# EAGLE design SmartDriveTestStand (EAGLE 9.1.3)
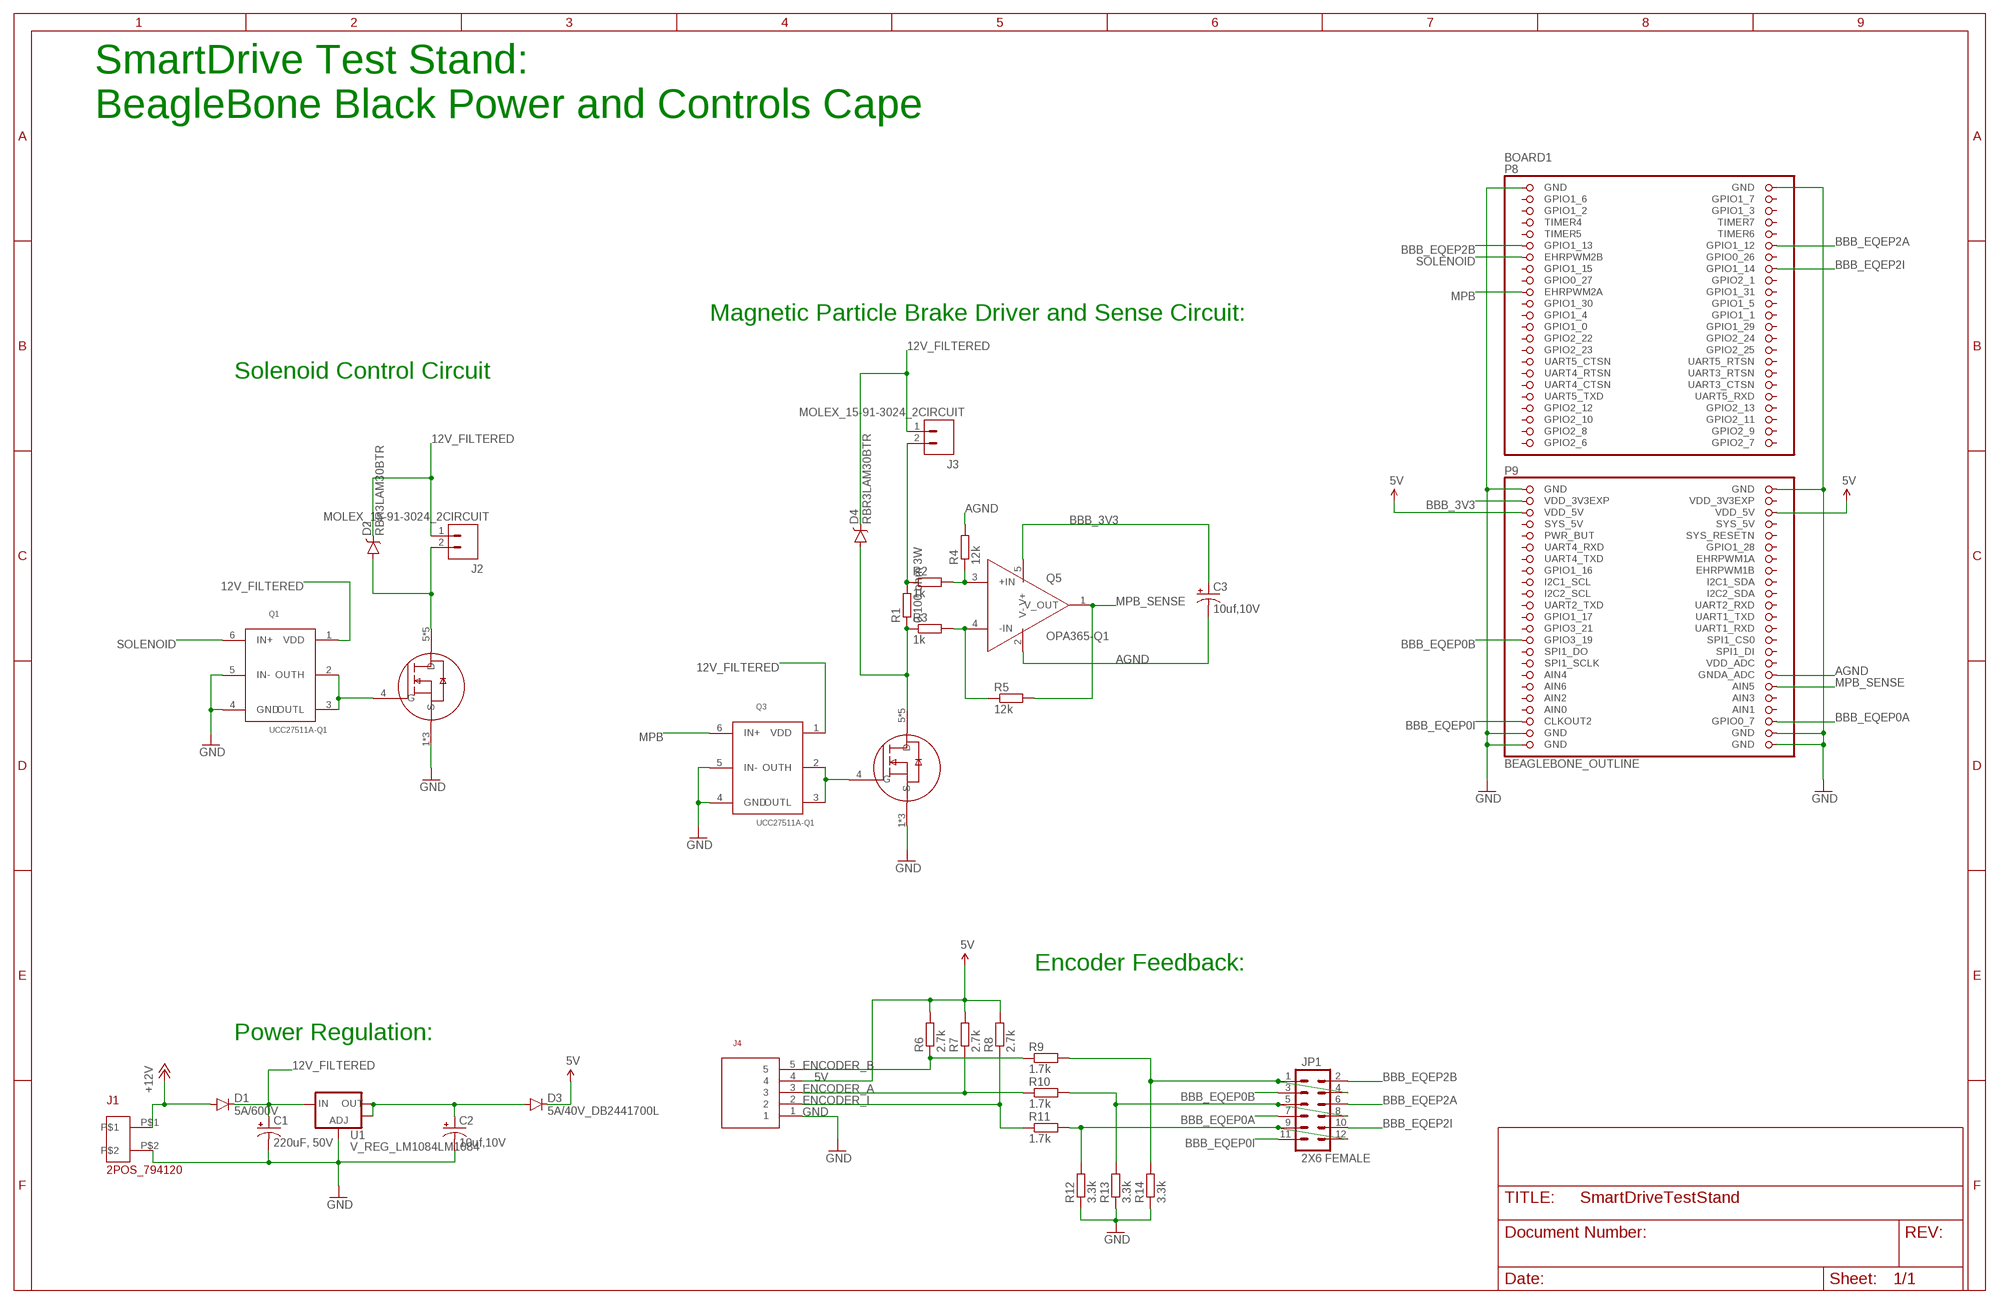
[diagram p0: schematic, sheet 1]

## Parts
BOARD1  BEAGLEBONE_OUTLINE  [BEAGLEBONE_SHIELD]
C1  220uF, 50V  CAP_POLG  [PANASONIC_G]
C2  10uf,10V  CAP_POL1206  [EIA3216]
C3  10uf,10V  CAP_POL1206  [EIA3216]
D1  5A/600V  DIODEES3J  [SMC]
D2  RBR3LAM30BTR  DIODE-SCHOTTKYRBR3LAM30B  [SMA-DIODE]
D3  5A/40V_DB2441700L  DIODESMA-ALT  [SMA-DIODE_ALT]
D4  RBR3LAM30BTR  DIODE-SCHOTTKYRBR3LAM30B  [SMA-DIODE]
J1  2POS_794120  [2POS_794120-1]
J2  MOLEX_15-91-3024_2CIRCUIT  [MOLEX15-91-3024_2CIRCUIT]
J3  MOLEX_15-91-3024_2CIRCUIT  [MOLEX15-91-3024_2CIRCUIT]
J4  MOLEX_15-91-3053_5CIRCUIT  [MOLEX15-91-3053-5CIRCUIT]
JP1  2X6 FEMALE  M06X2PTH_FEMALE  [2X6]
Q1  UCC27511A-Q1  [SOT23-6]
Q2  MOSFET_NCHANNELTI_CSD18533Q5A  [SON_5X6MM_NEXFET]
Q3  UCC27511A-Q1  [SOT23-6]
Q4  MOSFET_NCHANNELTI_CSD18533Q5A  [SON_5X6MM_NEXFET]
Q5  OPA365-Q1  [SOT23-5]
R1  0.100 ohm 3W  RESISTOR-2512  [RESISTOR-2512]
R2  1k  RESISTOR-0603  [RESISTOR-0603]
R3  1k  RESISTOR-0603  [RESISTOR-0603]
R4  12k  RESISTOR-0603  [RESISTOR-0603]
R5  12k  RESISTOR-0603  [RESISTOR-0603]
R6  2.7k  RESISTOR-0603  [RESISTOR-0603]
R7  2.7k  RESISTOR-0603  [RESISTOR-0603]
R8  2.7k  RESISTOR-0603  [RESISTOR-0603]
R9  1.7k  RESISTOR-0603  [RESISTOR-0603]
R10  1.7k  RESISTOR-0603  [RESISTOR-0603]
R11  1.7k  RESISTOR-0603  [RESISTOR-0603]
R12  3.3k  RESISTOR-0603  [RESISTOR-0603]
R13  3.3k  RESISTOR-0603  [RESISTOR-0603]
R14  3.3k  RESISTOR-0603  [RESISTOR-0603]
U1  V_REG_LM1084LM1084  [TO-263-3]

## Nets
5V: BOARD1.51(VDD_5V) BOARD1.52(VDD_5V) D3.C J4.4 R6.P$2 R7.P$2 R8.P$2
12V_FILTERED: C1.+ D1.C D2.C D4.C J2.1 J3.1 Q1.1(VDD) Q3.1(VDD) U1.3(IN)
+12V: D1.A J1.P$1
AGND: BOARD1.80(GNDA_ADC) C3.C(-) Q5.2(V-) R4.P$2
BBB_3V3: BOARD1.49(VDD_3V3EXP) C3.A(+) Q5.5(V+)
BBB_EQEP0A: BOARD1.88(GPIO0_7) JP1.7
BBB_EQEP0B: BOARD1.73(GPIO3_19) JP1.3
BBB_EQEP0I: BOARD1.87(CLKOUT2) JP1.11
BBB_EQEP2A: BOARD1.12(GPIO1_12) JP1.6
BBB_EQEP2B: BOARD1.11(GPIO1_13) JP1.2
BBB_EQEP2I: BOARD1.16(GPIO1_14) JP1.10
ENCA_1V8: JP1.5 JP1.8 R10.P$2 R13.P$2
ENCB_1V8: JP1.1 JP1.4 R9.P$2 R14.P$2
ENCI_1V8: JP1.9 JP1.12 R11.P$2 R12.P$2
ENCODER_A: J4.3 R7.P$1 R10.P$1
ENCODER_B: J4.5 R6.P$1 R9.P$1
ENCODER_I: J4.2 R8.P$1 R11.P$1
GND: BOARD1.1(GND) BOARD1.2(GND) BOARD1.47(GND) BOARD1.48(GND) BOARD1.89(GND) BOARD1.90(GND) BOARD1.91(GND) BOARD1.92(GND) C1.- C2.C(-) J1.P$2 J4.1 Q1.4(GND) Q1.5(IN-) Q2.1(S) Q2.2(S) Q2.3(S) Q3.4(GND) Q3.5(IN-) Q4.1(S) Q4.2(S) Q4.3(S) R12.P$1 R13.P$1 R14.P$1 U1.1(ADJ)
MPB: BOARD1.19(EHRPWM2A) Q3.6(IN+)
MPB_SENSE: BOARD1.82(AIN5) Q5.1(V_OUT) R5.P$2
N$1: Q3.2(OUTH) Q3.3(OUTL) Q4.4(G)
N$2: D4.A Q4.5(D) Q4.6(D) Q4.7(D) Q4.8(D) Q4.PAD(D) R1.1 R3.P$1
N$4: Q5.3(+IN) R2.P$2 R4.P$1
N$5: Q5.4(-IN) R3.P$2 R5.P$1
N$6: Q1.2(OUTH) Q1.3(OUTL) Q2.4(G)
N$7: D2.A J2.2 Q2.5(D) Q2.6(D) Q2.7(D) Q2.8(D) Q2.PAD(D)
N$8: J3.2 R1.2 R2.P$1
SOLENOID: BOARD1.13(EHRPWM2B) Q1.6(IN+)
VOUT: C2.A(+) D3.A U1.2(OUT) U1.4(OUT)
Unconnected: BOARD1.3(GPIO1_6) BOARD1.4(GPIO1_7) BOARD1.5(GPIO1_2) BOARD1.6(GPIO1_3) BOARD1.7(TIMER4) BOARD1.8(TIMER7) BOARD1.9(TIMER5) BOARD1.10(TIMER6) BOARD1.14(GPIO0_26) BOARD1.15(GPIO1_15) BOARD1.17(GPIO0_27) BOARD1.18(GPIO2_1) BOARD1.20(GPIO1_31) BOARD1.21(GPIO1_30) BOARD1.22(GPIO1_5) BOARD1.23(GPIO1_4) BOARD1.24(GPIO1_1) BOARD1.25(GPIO1_0) BOARD1.26(GPIO1_29) BOARD1.27(GPIO2_22) BOARD1.28(GPIO2_24) BOARD1.29(GPIO2_23) BOARD1.30(GPIO2_25) BOARD1.31(UART5_CTSN) BOARD1.32(UART5_RTSN) BOARD1.33(UART4_RTSN) BOARD1.34(UART3_RTSN) BOARD1.35(UART4_CTSN) BOARD1.36(UART3_CTSN) BOARD1.37(UART5_TXD) BOARD1.38(UART5_RXD) BOARD1.39(GPIO2_12) BOARD1.40(GPIO2_13) BOARD1.41(GPIO2_10) BOARD1.42(GPIO2_11) BOARD1.43(GPIO2_8) BOARD1.44(GPIO2_9) BOARD1.45(GPIO2_6) BOARD1.46(GPIO2_7) BOARD1.54(SYS_5V) BOARD1.55(PWR_BUT) BOARD1.56(SYS_RESETN) BOARD1.57(UART4_RXD) BOARD1.58(GPIO1_28) BOARD1.59(UART4_TXD) BOARD1.60(EHRPWM1A) BOARD1.61(GPIO1_16) BOARD1.62(EHRPWM1B) BOARD1.63(I2C1_SCL) BOARD1.64(I2C1_SDA) BOARD1.65(I2C2_SCL) BOARD1.66(I2C2_SDA) BOARD1.67(UART2_TXD) BOARD1.68(UART2_RXD) BOARD1.69(GPIO1_17) BOARD1.70(UART1_TXD) BOARD1.71(GPIO3_21) BOARD1.72(UART1_RXD) BOARD1.74(SPI1_CS0) BOARD1.75(SPI1_DO) BOARD1.76(SPI1_DI) BOARD1.77(SPI1_SCLK) BOARD1.78(VDD_ADC) BOARD1.79(AIN4) BOARD1.81(AIN6) BOARD1.83(AIN2) BOARD1.84(AIN3) BOARD1.86(AIN1)

## Notes on the sheet
- SmartDrive Test Stand: 
  BeagleBone Black Power and Controls Cape
- Magnetic Particle Brake Driver and Sense Circuit:
- Solenoid Control Circuit
- Encoder Feedback:
- Power Regulation:

## Power pins joined to a net without a drawn wire
AIN0: BOARD1.85(AIN0)
SYS_5V: BOARD1.53(SYS_5V)
VDD_3V3EXP: BOARD1.50(VDD_3V3EXP)

## Library data of the parts
BOARD1 = adafruit:BEAGLEBONE_OUTLINE: Should match A3 pinout - but not completely tested
C1 = SmartDrive-TestStand:CAP_POL: Capacitor Polarized These are standard SMD and PTH capacitors. Normally 10uF, 47uF, and 100uF in electrolytic and tantalum varieties. Always verify the external diameter of the through hole cap, it varies with capacity, voltage, and manufacturer. The EIA devices should be standard.; MANEX: 123-0004264
C2 C3 = SparkFun-Passives:CAP_POL: Capacitor Polarized These are standard SMD and PTH capacitors. Normally 10uF, 47uF, and 100uF in electrolytic and tantalum varieties. Always verify the external diameter of the through hole cap, it varies with capacity, voltage, and manufacturer. The EIA devices should be standard.; MANEX: 123-0001192
D1 = SparkFun-DiscreteSemi:DIODE: Diode These are standard reverse protection diodes and small signal diodes. SMA package can handle up to about 1A. SOD-323 can handle about 200mA. What the SOD-323 package when ordering, there are some mfgs out there that are 5-pin packages.; MANEX: 130-0001388; PROD_ID: DIO-12441; VALUE: 3A/600V
D2 D4 = SmartDrive-TestStand:DIODE-SCHOTTKY: Schottky diodes
D3 = SparkFun-DiscreteSemi:DIODE: Diode These are standard reverse protection diodes and small signal diodes. SMA package can handle up to about 1A. SOD-323 can handle about 200mA. What the SOD-323 package when ordering, there are some mfgs out there that are 5-pin packages.; MANEX: 130-0002546
J1 = AMP_Mate_N_lock_conncetor:2POS_794120
J2 J3 = SmartDrive-TestStand:MOLEX_15-91-3024_2CIRCUIT: MOLEX 15-91-3024 2 position connector; MANEX: 257-0004040
J4 = SmartDrive-TestStand:MOLEX_15-91-3053_5CIRCUIT
JP1 = SparkFun-Connectors:M06X2; PROD_ID: CONN-12423
Q1 Q3 = SmartDrive-TestStand:UCC27511A-Q1
Q2 Q4 = SmartDrive-TestStand:MOSFET_NCHANNEL: N-Channel QFET MOSFET FQB30N06L 60V, 32A, 35mOhm
Q5 = SmartDrive-TestStand:OPA365-Q1: OPA365-Q1 50MHz Low-Distortion High-CMRR Rail-to-Rail I/O, Single-Supply Operational Amplifier
R1 = SmartDrive-TestStand:RESISTOR-2512: Resistor SMD 2512
R2-R14 = SmartDrive-TestStand:RESISTOR-0603: Resistor 0603 SMD
U1 = SmartDrive-TestStand:V_REG_LM1084: LM1084 5A low-drop positive voltage regulator The LM1084xx is a low drop voltage regulator able to provide up to 5 A of output current. Dropout is guaranteed at a maximum of 1.5 V at the maximum output current, decreasing at lower loads. The LM1084xx is pin to pin compatible with the older 3-terminal adjustable regulators, but has better performances in term of drop and output tolerance.

## Net classes
0 default: width 0.152 mm, drill 0.305 mm, clearance 0.152 mm

## Board
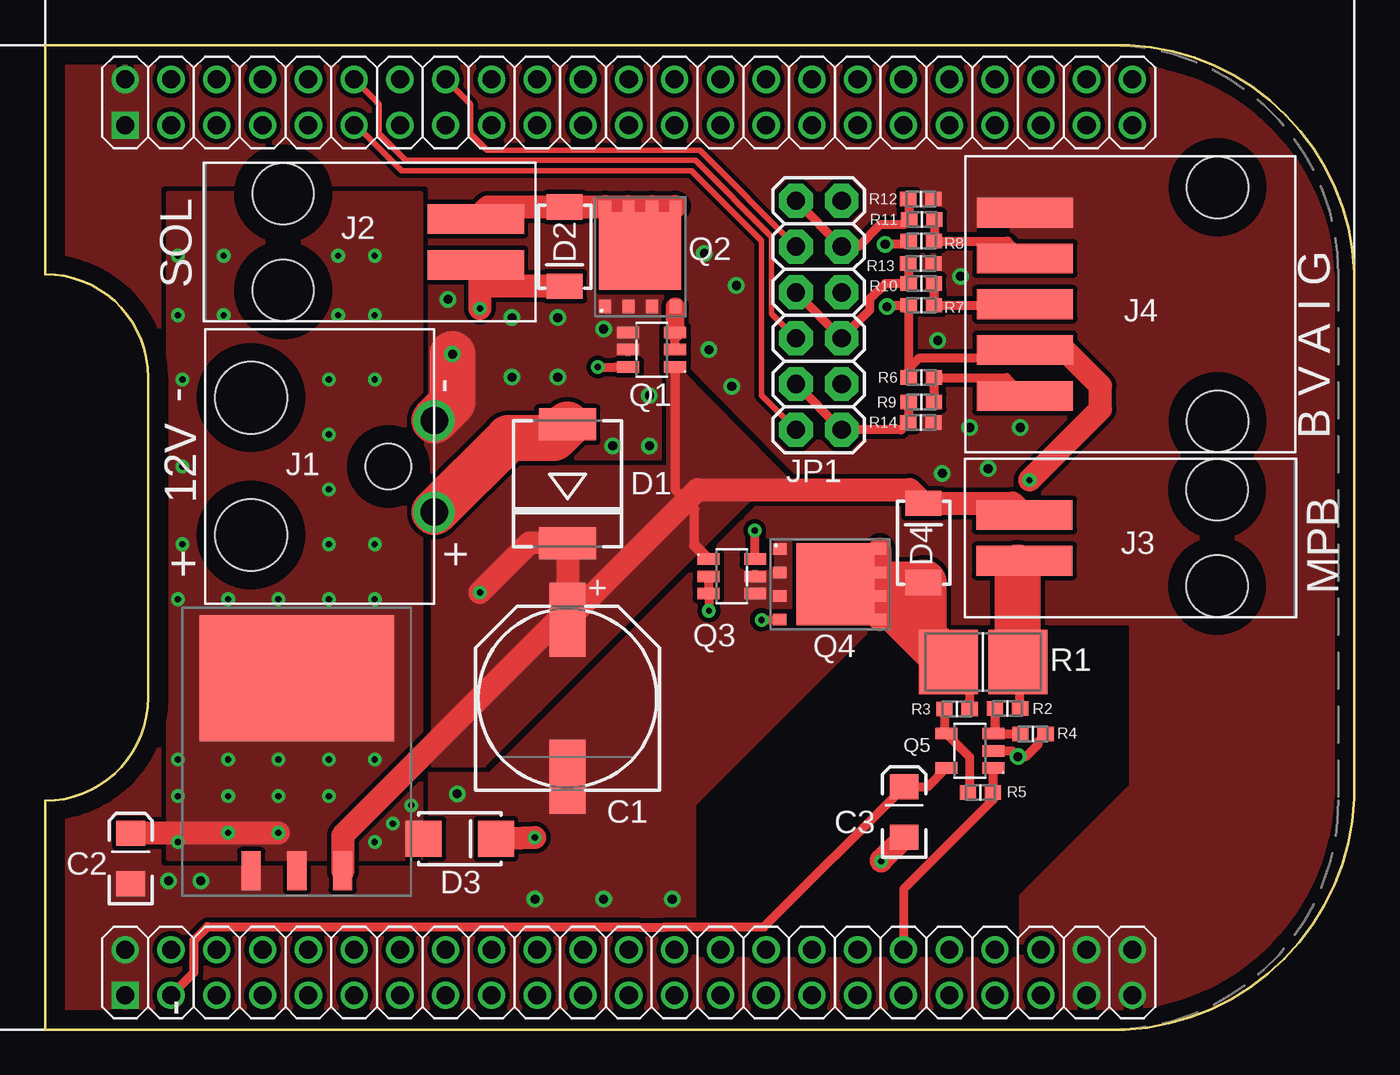
[diagram p1: board, top side]
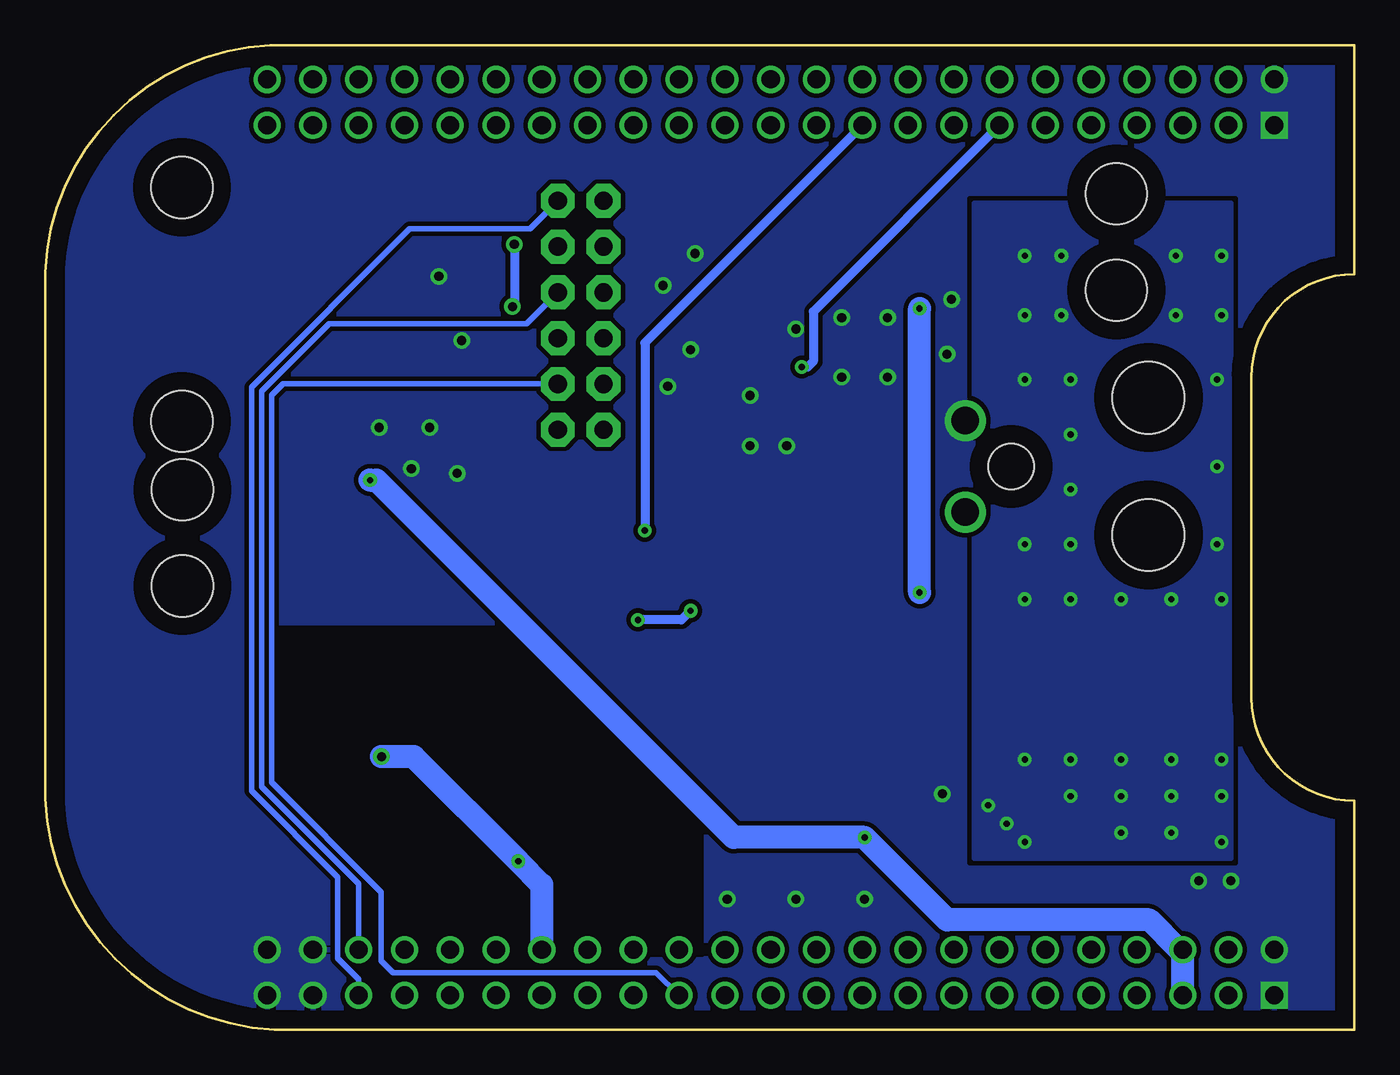
[diagram p2: board, bottom side, seen from below]

Size 72.64 x 54.61 mm. Coordinates in mm from the lower left corner, seen from the top.
Outline: 58.67,0 0,0 0,12.7 arc90 5.71,18.41 5.71,36.2 arc90 0,41.91 0,54.61 58.93,54.61 arc-90 72.64,42.01 72.64,12.8 arc-90 58.67,0
Copper layers (1*16): Top 0.035mm / dielectric 1.5mm / Bottom 0.035mm
Design rules "TestStand": minimum track width 12mil, minimum drill 0.35mm, track to track 10mil, track to pad 10mil, pad to pad 10mil, via to via 10mil, smd to smd 10mil, copper to edge 40mil, drill to drill 6mil, minimum pad ring 10mil, minimum via ring 8mil, stop-mask expansion 4mil, vias tented up to drill 0mil, thermal gap 0mil

### Footprints (pad centres in the part's own frame; a part is rotated, then mirrored left to right if it is on the bottom)
BEAGLEBONE_SHIELD = drill 1 square: 1 4.445,19.05; 47 52.705,19.05 | drill 1: 2 1.905,19.05; 3 4.445,21.59; 4 1.905,21.59; 5 4.445,24.13; 6 1.905,24.13; 7 4.445,26.67; 8 1.905,26.67; 9 4.445,29.21; 10 1.905,29.21; 11 4.445,31.75; 12 1.905,31.75; 13 4.445,34.29; 14 1.905,34.29; 15 4.445,36.83; 16 1.905,36.83; 17 4.445,39.37; 18 1.905,39.37; 19 4.445,41.91; 20 1.905,41.91; 21 4.445,44.45; 22 1.905,44.45; 23 4.445,46.99; 24 1.905,46.99; 25 4.445,49.53; 26 1.905,49.53; 27 4.445,52.07; 28 1.905,52.07; 29 4.445,54.61; 30 1.905,54.61; 31 4.445,57.15; 32 1.905,57.15; 33 4.445,59.69; 34 1.905,59.69; 35 4.445,62.23; 36 1.905,62.23; 37 4.445,64.77; 38 1.905,64.77; 39 4.445,67.31; 40 1.905,67.31; 41 4.445,69.85; 42 1.905,69.85; 43 4.445,72.39; 44 1.905,72.39; 45 4.445,74.93; 46 1.905,74.93; 48 50.165,19.05; 49 52.705,21.59; 50 50.165,21.59; 51 52.705,24.13; 52 50.165,24.13; 53 52.705,26.67; 54 50.165,26.67; 55 52.705,29.21; 56 50.165,29.21; 57 52.705,31.75; 58 50.165,31.75; 59 52.705,34.29; 60 50.165,34.29; 61 52.705,36.83; 62 50.165,36.83; 63 52.705,39.37; 64 50.165,39.37; 65 52.705,41.91; 66 50.165,41.91; 67 52.705,44.45; 68 50.165,44.45; 69 52.705,46.99; 70 50.165,46.99; 71 52.705,49.53; 72 50.165,49.53; 73 52.705,52.07; 74 50.165,52.07; 75 52.705,54.61; 76 50.165,54.61; 77 52.705,57.15; 78 50.165,57.15; 79 52.705,59.69; 80 50.165,59.69; 81 52.705,62.23; 82 50.165,62.23; 83 52.705,64.77; 84 50.165,64.77; 85 52.705,67.31; 86 50.165,67.31; 87 52.705,69.85; 88 50.165,69.85; 89 52.705,72.39; 90 50.165,72.39; 91 52.705,74.93; 92 50.165,74.93
PANASONIC_G = smd 4.1 x 2: + 4.35,0; - -4.35,0
EIA3216 = smd 1.4 x 1.6: A 1.4,0; C -1.4,0
SMC = smd 1.778 x 3.175: A 3.302,0; C -3.302,0
SMA-DIODE = smd 1.4 x 2: A -2.2,0; C 2.2,0
SMA-DIODE_ALT = smd 2 x 2: A -2,0; C 2,0
2POS_794120-1 = drill 1.524: P$1 -2.54,0; P$2 2.54,0 | hole 2.54: 0,2.54 | hole 3.988: 3.81,10.16; -3.81,10.16
MOLEX15-91-3024_2CIRCUIT = smd 1.65 x 5.33: 1 1.27,10.69; 2 -1.27,10.69 | hole 3.4: 2.67,0; -2.67,0
MOLEX15-91-3053-5CIRCUIT = smd 1.65 x 5.33: 1 5.08,10.69; 2 2.54,10.69; 3 0,10.69; 4 -2.54,10.69; 5 -5.08,10.69 | hole 3.4: 6.48,0; -6.48,0
2X6 = drill 1.016 pad 1.88 octagon: 1 0,0; 2 0,2.54; 3 2.54,0; 4 2.54,2.54; 5 5.08,0; 6 5.08,2.54; 7 7.62,0; 8 7.62,2.54; 9 10.16,0; 10 10.16,2.54; 11 12.7,0; 12 12.7,2.54
SOT23-6 = smd 1.27 x 0.635: 1 -1.3,0.95; 2 -1.3,0; 3 -1.3,-0.95; 4 1.3,-0.95; 5 1.3,0; 6 1.3,0.95
SON_5X6MM_NEXFET = smd 0.75 x 0.65: 1 3.075,-1.95; 2 3.075,-0.65; 3 3.075,0.65; 4 3.075,1.95 | smd 0.65 x 0.65: 5 -2.475,1.95; 6 -2.475,0.65; 7 -2.475,-0.65; 8 -2.475,-1.95 | smd 4.3 x 4.55: PAD 0,0
SOT23-5 = smd 1.27 x 0.635: 1 -1.3,0.95; 2 -1.3,0; 3 -1.3,-0.95; 4 1.3,-0.95; 5 1.3,0.95
RESISTOR-2512 = smd 3.25 x 3.6: 1 -1.925,0; 2 1.925,0
RESISTOR-0603 = smd 0.9 x 0.8: P$1 -0.7,0; P$2 0.7,0
TO-263-3 = smd 1.07 x 2.16: 1 -2.54,-14.17; 2 0,-14.17; 3 2.54,-14.17 | smd 10.8 x 7: 4 0,-3.5

### Placement (x,y rotation side)
BOARD1  -14.61,54.61 270 top
C1  28.98,18.39 90 top
C2  4.75,9.5 90 top
C3  47.66,12.08 90 top
D1  28.98,30.28 90 top
D2  28.83,43.43 270 top
D3  23.01,10.59 0 top
D4  48.74,27 90 top
DRILEGEND  [DRILEGEND]  -4.06,-0.25 0 top  (outside the outline)
J1  21.59,31.24 90 top
J2  13.21,43.69 270 top
J3  65.02,27.28 90 top
J4  65.05,40.23 90 top
JP1  44.2,33.27 90 top
Q1  33.66,37.72 180 top
Q2  33.02,43.18 270 top
Q3  38.1,25.15 0 top
Q4  43.84,24.71 180 top
Q5  51.31,15.47 180 top
R1  52.04,20.4 0 top
R2  53.39,17.81 180 top
R3  50.6,17.78 180 top
R4  54.81,16.41 0 top
R5  51.89,13.16 0 top
R6  48.62,36.17 180 top
R7  48.62,40.18 180 top
R8  48.62,43.74 180 top
R9  48.62,34.82 180 top
R10  48.62,41.38 180 top
R11  48.64,44.93 180 top
R12  48.59,46.08 180 top
R13  48.59,42.49 180 top
R14  48.59,33.68 180 top
U1  13.97,22.99 0 top

### Tracks (layer width: path | path; a pad name or v marks a point on that pad's centre or on a via)
5V  (via drill 0.35, 0.51)
  Top 0.508: J4.4 53.9,37.23 48.46,37.23 48.46,37.22 47.92,36.68 R6.P$2 R7.P$2 46.79,40.18 v46.71,40.11 | R8.P$2 47.74,43.56 v46.61,43.56
  Top 1.27: J4.4 56.57,37.69 58.55,35.71 58.55,34.42 v54.61,30.48 | D3.C v27.18,10.67
  Bottom 0.508: v46.61,43.56 46.61,40.21 v46.71,40.11
  Bottom 1.27: BOARD1.51 BOARD1.52 9.74,4.45 11.38,6.09 22.6,6.09 v27.18,10.67 34.44,10.67 54.25,30.48 v54.61,30.48
12V_FILTERED  (via drill 0.35)
  Top 0.508: Q1.1 34.95,29.96 36.04,28.88 36.04,26.86
  Top 0.61: Q3.1 36.04,26.86
  Top 1.27: J3.1 53.68,29.2 D4.C 47.98,29.96 36.2,29.96 C1.+ | U1.3 16.51,10.78 28.47,22.74 C1.+ | v24.13,40.01 24.13,41.28 | 24.13,41.28 24.13,42.42 J2.1 | D2.C 24.13,41.23 24.13,41.28 | v24.13,24.26 26.87,27 D1.C C1.+
  Bottom 1.27: v24.13,24.26 v24.13,40.01
  pour Top: 21.46,14.61 21.46,28.57 24.13,31.24 34.54,31.24 34.54,34.8 34.54,36.7 35.18,36.7 42.29,29.46 39.24,29.46 27.43,17.65 24.38,14.61
+12V
  Top 2.54: J1.P$1 25.7,32.82 28.22,32.82 D1.A
AGND  (via drill 0.35, 0.51)
  Top 0.508: R4.P$2 55.07,15.97 55.07,15.8 54.42,15.14 v53.98,15.14 53.65,15.47 Q5.2
  Top 1.27: C3.C 46.39,9.4 v46.39,9.35
  Bottom 1.27: BOARD1.80 45.09,8.04 v46.39,9.35 52.19,15.14 v53.98,15.14
BBB_3V3
  Top 0.508: BOARD1.49 8.26,3.18 8.26,4.97 9.01,5.71 9.02,5.71 32.91,5.71 32.92,5.7 34.39,5.7 34.4,5.71 39.89,5.71 C3.A 48.97,13.48 Q5.5
BBB_EQEP0A
  Bottom 0.305: JP1.7 45.92,39.17 56.87,39.17 60.63,35.41 60.63,13.49 55.24,8.1 BOARD1.88
BBB_EQEP0B
  Bottom 0.305: JP1.3 59.44,35.81 60.07,35.18 60.07,13.72 53.99,7.64 53.99,3.83 53.34,3.17 38.73,3.17 BOARD1.73
BBB_EQEP0I
  Bottom 0.305: JP1.11 45.74,44.43 52.41,44.43 61.19,35.64 61.19,13.25 56.41,8.47 56.41,3.96 55.24,2.8 BOARD1.87
BBB_EQEP2A
  Top 0.305: JP1.6 40.31,39.7 40.31,43.99 36.09,48.21 20,48.21 18.52,49.68 18.52,51.33 BOARD1.12
BBB_EQEP2B
  Top 0.305: JP1.2 39.75,35.18 39.75,43.76 35.86,47.65 19.77,47.65 17.25,50.16 BOARD1.11
BBB_EQEP2I
  Top 0.305: JP1.10 36.32,48.77 24.52,48.77 23.61,49.68 23.61,51.33 BOARD1.16
ENCA_1V8
  Top 0.508: R13.P$2 47.92,42.49 R10.P$2 46.62,41.38 45.75,40.51 45.75,39.9 JP1.5 JP1.8
ENCB_1V8
  Top 0.508: R9.P$2 47.92,33.68 R14.P$2 47.48,33.27 JP1.1 JP1.4
ENCI_1V8
  Top 0.508: R12.P$2 47.94,46.08 R11.P$2 47.66,44.65 46.33,44.65 45.12,43.43 JP1.9 JP1.12
ENCODER_A
  Top 0.508: R10.P$1 R7.P$1 54.31,40.18 J4.3
ENCODER_B
  Top 0.508: R9.P$1 R6.P$1 53.34,36.17 J4.5
ENCODER_I
  Top 0.508: R11.P$1 49.34,43.76 R8.P$1 53.39,43.74 J4.2
EXCLUDE_REGION
  cutout Bottom: 36.17,4.11 36.17,12.45 36.2,12.45 46.1,22.35 60.07,22.35 60.07,16.51 60.07,13.59 53.98,7.49 51.9,4.11
  cutout Top: 36.2,4.11 36.2,12.45 46.1,22.35 60.07,22.35 60.07,16.51 60.07,13.59 53.98,7.49 53.98,4.11
  cutout Top: 39.88,27.18 40.39,27.18 40.39,25.65 39.88,25.65
GND  (via drill 0.51)
  Top 2.54: J1.P$2 22.61,34.8 v22.61,37.47
  other vias: 30.99,38.86 25.91,36.2 22.35,40.51 25.91,39.5 28.45,39.5 28.45,36.2 33.53,35.18 33.53,32.39 31.5,32.39 51.31,33.4 54.1,33.4 52.32,31.11 49.78,30.86 36.83,37.72 38.1,35.69 36.58,43.05 38.35,41.28 8.64,8.26 6.86,8.26 22.86,13.08 34.8,7.24 30.99,7.24 27.18,7.24 50.8,41.78 49.53,38.23
  pour Bottom (rank 6): -1.8,55.63 -1.8,-0.25 76.58,-0.25 76.58,55.63
  pour Top (rank 6): -1.68,55.63 -1.68,-0.25 76.56,-0.25 76.56,55.63
  pour Top: 40.39,27.18 40.39,23.62 41.4,23.62 41.4,27.18
  pour Top: 30.73,40.89 34.29,40.89 34.29,39.37 30.73,39.37
MPB  (via drill 0.35)
  Top 0.508: v39.37,27.69 39.37,26.13 Q3.6
  Bottom 0.508: BOARD1.19 39.37,38.1 v39.37,27.69
MPB_SENSE
  Top 0.508: Q5.1 52.59,14.5 R5.P$2 52.59,12.75 47.62,7.78 BOARD1.82
N$1  (via drill 0.35)
  Top 0.508: Q3.2 Q3.3 36.83,24.17 v36.83,23.24 | v39.75,22.73 40.74,22.73 Q4.4
  Bottom 0.508: v36.83,23.24 37.34,22.73 v39.75,22.73
N$2
  Top 0.508: R3.P$1 51.3,19.22 R1.1 | Q4.7 45.67,24.71 Q4.PAD
  Top 1.27: Q4.8 Q4.7 Q4.6 Q4.5
  Top 2.54: Q4.PAD 48.65,24.71 D4.A 48.74,21.77 R1.1 45.81,24.71 Q4.PAD
N$4
  Top 0.508: R2.P$2 52.69,16.5 Q5.3 54.1,16.42 R4.P$1
N$5
  Top 0.508: R3.P$2 49.9,16.53 | 49.9,16.53 Q5.4 | 49.9,16.53 51.31,15.12 51.31,13.27 R5.P$1
N$6
  Top 0.508: Q1.2 Q1.3
  Top 1.016: Q1.3 34.95,40.09 Q2.4
N$7
  Top 0.508: Q2.6 33.02,45.01 Q2.PAD
  Top 1.27: Q2.5 Q2.6 Q2.7 Q2.8 31.05,45.63 D2.A 24.57,45.63 J2.2
N$8
  Top 0.508: R2.P$1 54.09,20.27 R1.2
  Top 1.27: J3.2 53.95,25.63
  Top 2.54: 53.95,25.63 53.95,20.41 R1.2
SOLENOID  (via drill 0.35)
  Top 0.508: v30.66,36.76 v30.66,36.75 31.64,36.75 31.66,36.77 Q1.6
  Bottom 0.508: BOARD1.13 30.02,39.83 30.02,37.07 30.33,36.76 v30.66,36.76
VOUT  (via drill 0.35)
  Top 1.27: C2.A 4.75,10.92 v12.95,10.92
  other vias: 7.37,42.93 9.91,42.93 16.26,42.93 18.29,42.93 18.29,39.62 16.26,39.62 9.91,39.62 7.37,39.62 18.29,36.07 15.75,33.02 15.75,36.07 7.62,26.92 15.75,23.88 10.16,23.88 15.75,26.92 18.29,26.92 7.37,12.95 7.37,10.41 10.16,10.92 10.16,12.95 12.95,12.95 15.75,12.95 18.29,10.41 7.62,36.07 7.37,23.88 15.75,29.97 12.95,23.88 20.32,12.45 19.3,11.43 7.37,14.99 10.16,14.99 12.95,14.99 15.75,14.99 18.29,14.99 18.29,23.88 7.62,31.24
  pour Top: 6.86,9.53 6.86,46.36 20.83,46.36 20.83,9.53
  pour Bottom: 6.86,45.85 6.86,9.53 21.08,9.53 21.08,45.85

### Text on the board
tPlace: SOL | - | - | B V A I G | 12V | + | + | MPB | -